# Altium schematic sheet GLCD.SchDoc
size A4; SheetNumber: 5; SheetTotal: 7
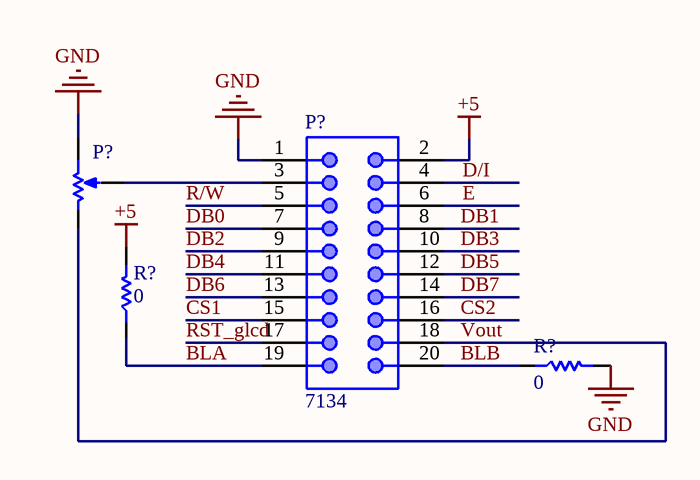
[diagram p0: GLCD.SchDoc]

## Parts
(Parts that share a designator on the sheet are numbered #1, #2 ... from top to bottom, then left to right.)
P?#1  Inflow: 7134  [BOX-HDR-10X2-2.54mm-S]  (hidden comment: 10x2)
P?#2  10K  [Multi turn 01]  (value not drawn)
R?#1  0  [RES 1206 (3216X08L)]
R?#2  0  [RES 1206 (3216X08L)]

## Nets
+5: P?#1.2 R?#1.2
GND: P?#1.1 P?#2.1 R?#2.2
BLA: P?#1.19 R?#1.1
BLB: P?#1.20 R?#2.1
CS1: P?#1.15
CS2: P?#1.16
D/I: P?#1.4
DB0: P?#1.7
DB1: P?#1.8
DB2: P?#1.9
DB3: P?#1.10
DB4: P?#1.11
DB5: P?#1.12
DB6: P?#1.13
DB7: P?#1.14
E: P?#1.6
R/W: P?#1.5
RST_glcd: P?#1.17
Vout: P?#1.18 P?#2.3
NetP?#1_3: P?#1.3 P?#2.2

## Library data of the parts
P?#1 = Con_IDC_10x2: Male Box Header, 20 pins; Rating: Rating?; Validation: NT; Value: 10x2; Package: Package?; Type: Type?
P?#2 = Res_Multi: Multi Turn; Rating: Rating?; Validation: Valid; Inflow: inflow?; Package: Package?; Type: Type?; Value: 10K
R?#1 R?#2 = Res_SMD_1206: Resistor; Inflow: inflow?; Rating: 0.25W; Validation: Valid; Package: 1206; Type: 10%; Value: 0